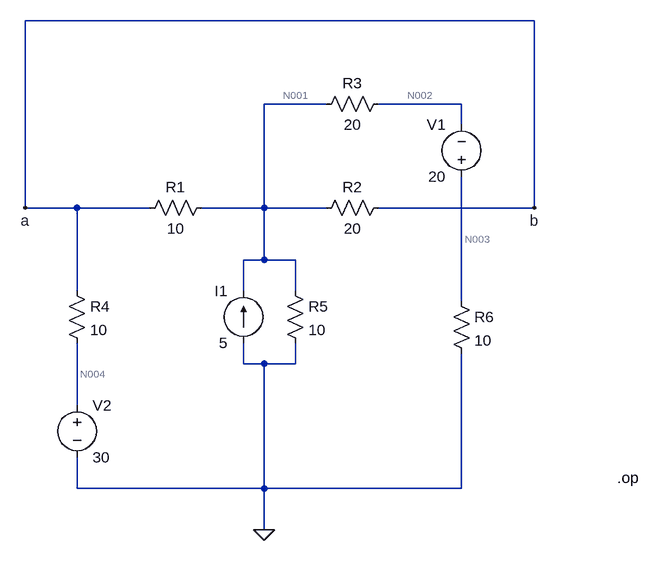
[diagram p0: schematic Draft1.asc]
Draft1.asc, the LTspice schematic file:
Version 4
SHEET 1 880 680
WIRE 688 -176 -96 -176
WIRE 368 -48 272 -48
WIRE 576 -48 448 -48
WIRE 576 -16 576 -48
WIRE -96 112 -96 -176
WIRE -16 112 -96 112
WIRE 96 112 -16 112
WIRE 272 112 272 -48
WIRE 272 112 176 112
WIRE 368 112 272 112
WIRE 688 112 688 -176
WIRE 688 112 448 112
WIRE 272 192 272 112
WIRE 272 192 240 192
WIRE 320 192 272 192
WIRE -16 240 -16 112
WIRE 240 240 240 192
WIRE 320 240 320 192
WIRE 576 256 576 64
WIRE 240 352 240 320
WIRE 272 352 240 352
WIRE 320 352 320 320
WIRE 320 352 272 352
WIRE -16 416 -16 320
WIRE -16 544 -16 496
WIRE 272 544 272 352
WIRE 272 544 -16 544
WIRE 576 544 576 336
WIRE 576 544 272 544
WIRE 272 608 272 544
FLAG 272 608 0
FLAG -96 112 a
FLAG 688 112 b
SYMBOL res 192 96 R90
WINDOW 0 0 56 VBottom 2
WINDOW 3 32 56 VTop 2
SYMATTR InstName R1
SYMATTR Value 10
SYMBOL res 464 96 R90
WINDOW 0 0 56 VBottom 2
WINDOW 3 32 56 VTop 2
SYMATTR InstName R2
SYMATTR Value 20
SYMBOL res 464 -64 R90
WINDOW 0 0 56 VBottom 2
WINDOW 3 32 56 VTop 2
SYMATTR InstName R3
SYMATTR Value 20
SYMBOL res -32 224 R0
SYMATTR InstName R4
SYMATTR Value 10
SYMBOL res 304 224 R0
SYMATTR InstName R5
SYMATTR Value 10
SYMBOL res 560 240 R0
SYMATTR InstName R6
SYMATTR Value 10
SYMBOL voltage 576 80 R180
WINDOW 0 24 96 Left 2
WINDOW 3 24 16 Left 2
WINDOW 123 0 0 Left 0
WINDOW 39 0 0 Left 0
SYMATTR InstName V1
SYMATTR Value 20
SYMBOL voltage -16 400 R0
WINDOW 123 0 0 Left 0
WINDOW 39 0 0 Left 0
SYMATTR InstName V2
SYMATTR Value 30
SYMBOL current 240 320 R180
WINDOW 0 24 80 Left 2
WINDOW 3 24 0 Left 2
WINDOW 123 0 0 Left 0
WINDOW 39 0 0 Left 0
SYMATTR InstName I1
SYMATTR Value 5
TEXT 816 528 Left 2 !.op

The netlist it stands for:
* Draft1.asc
R1 N001 b 10
R2 b N001 20
R3 N002 N001 20
R4 b N004 10
R5 N001 0 10
R6 N003 0 10
V1 N003 N002 20
V2 N004 0 30
I1 0 N001 5
.op
.backanno
.end

* Results of the author's LTspice run, read from the files saved beside the schematic
* Operating Point:
*   V(n001) = 31.72 V
*   V(b) = 31.03 V
*   V(n002) = -2.759 V
*   V(n004) = 30 V
*   V(n003) = 17.24 V
*   I(I1) = 5 A
*   I(R6) = 1.724 A
*   I(R5) = 3.172 A
*   I(R4) = 103.4 mA
*   I(R3) = -1.724 A
*   I(R2) = -34.48 mA
*   I(R1) = 68.97 mA
*   I(V2) = 103.4 mA
*   I(V1) = -1.724 A